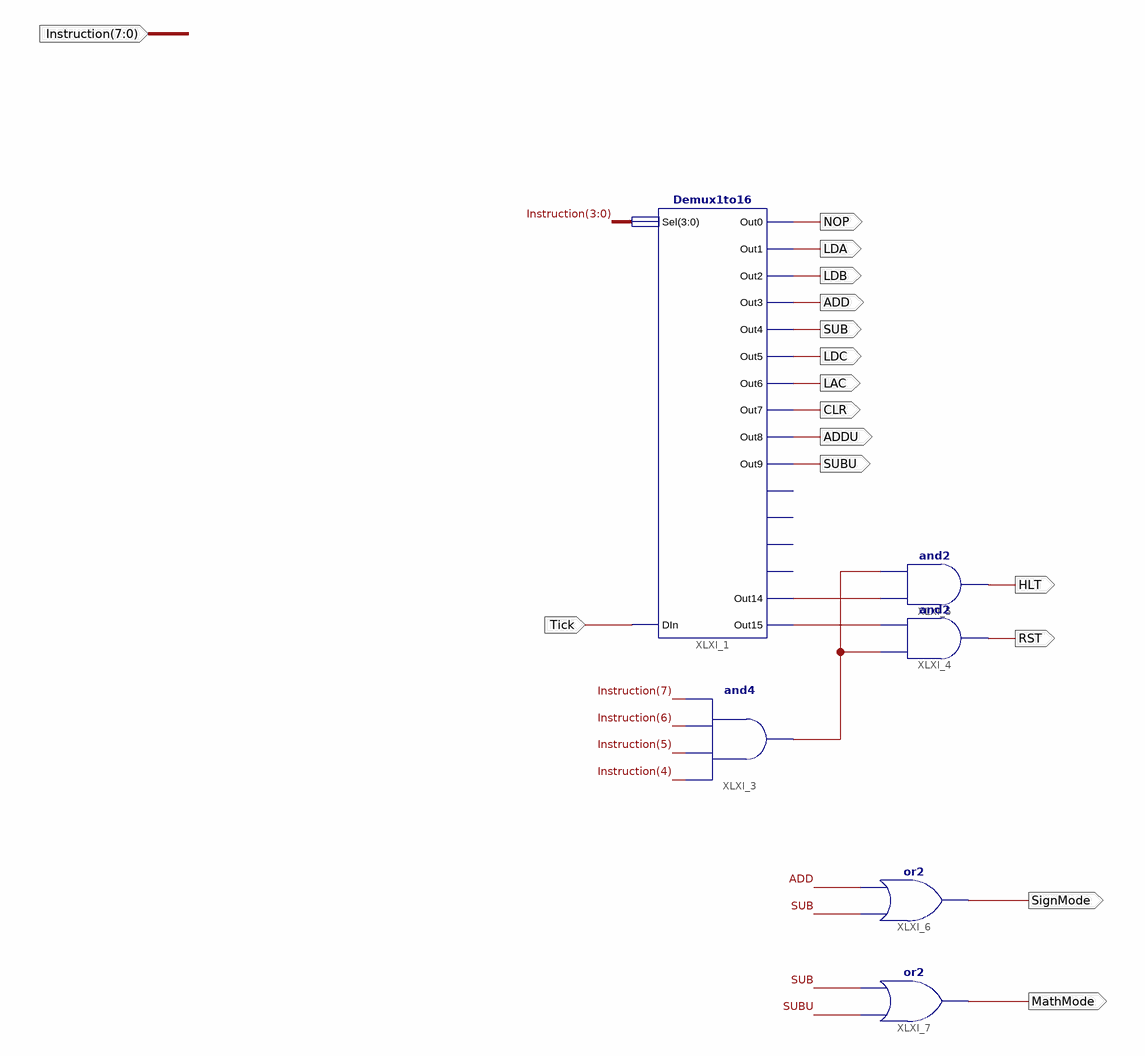
[diagram p0: schematic sheet 1]
// Xilinx ISE schematic InstructionDecode.sch (spartan3e) as structural Verilog: 6 symbols, 16 ports
module InstructionDecode (
  input  [7:0] Instruction,
  input  Tick,
  output NOP,
  output LDA,
  output LDB,
  output ADD,
  output SUB,
  output LDC,
  output LAC,
  output CLR,
  output ADDU,
  output SUBU,
  output HLT,
  output RST,
  output SignMode,
  output MathMode
);

  wire XLXN_24, XLXN_25, XLXN_27;

  Demux1to16 XLXI_1 (
    .Sel(Instruction[3:0]), .DIn(Tick), .Out0(NOP), .Out1(LDA), .Out2(LDB), .Out3(ADD), .Out7(CLR),
    .Out6(LAC), .Out5(LDC), .Out4(SUB), .Out9(SUBU), .Out8(ADDU), .Out15(XLXN_24), .Out14(XLXN_25));  // open: Out11, Out10, Out13, Out12
  and XLXI_3 (XLXN_27, Instruction[4], Instruction[5], Instruction[6], Instruction[7]);
  and XLXI_4 (RST, XLXN_27, XLXN_24);
  and XLXI_5 (HLT, XLXN_25, XLXN_27);
  or XLXI_6 (SignMode, SUB, ADD);
  or XLXI_7 (MathMode, SUBU, SUB);
endmodule
